# EAGLE design BUS_TEE_1 (EAGLE 6.5.0)
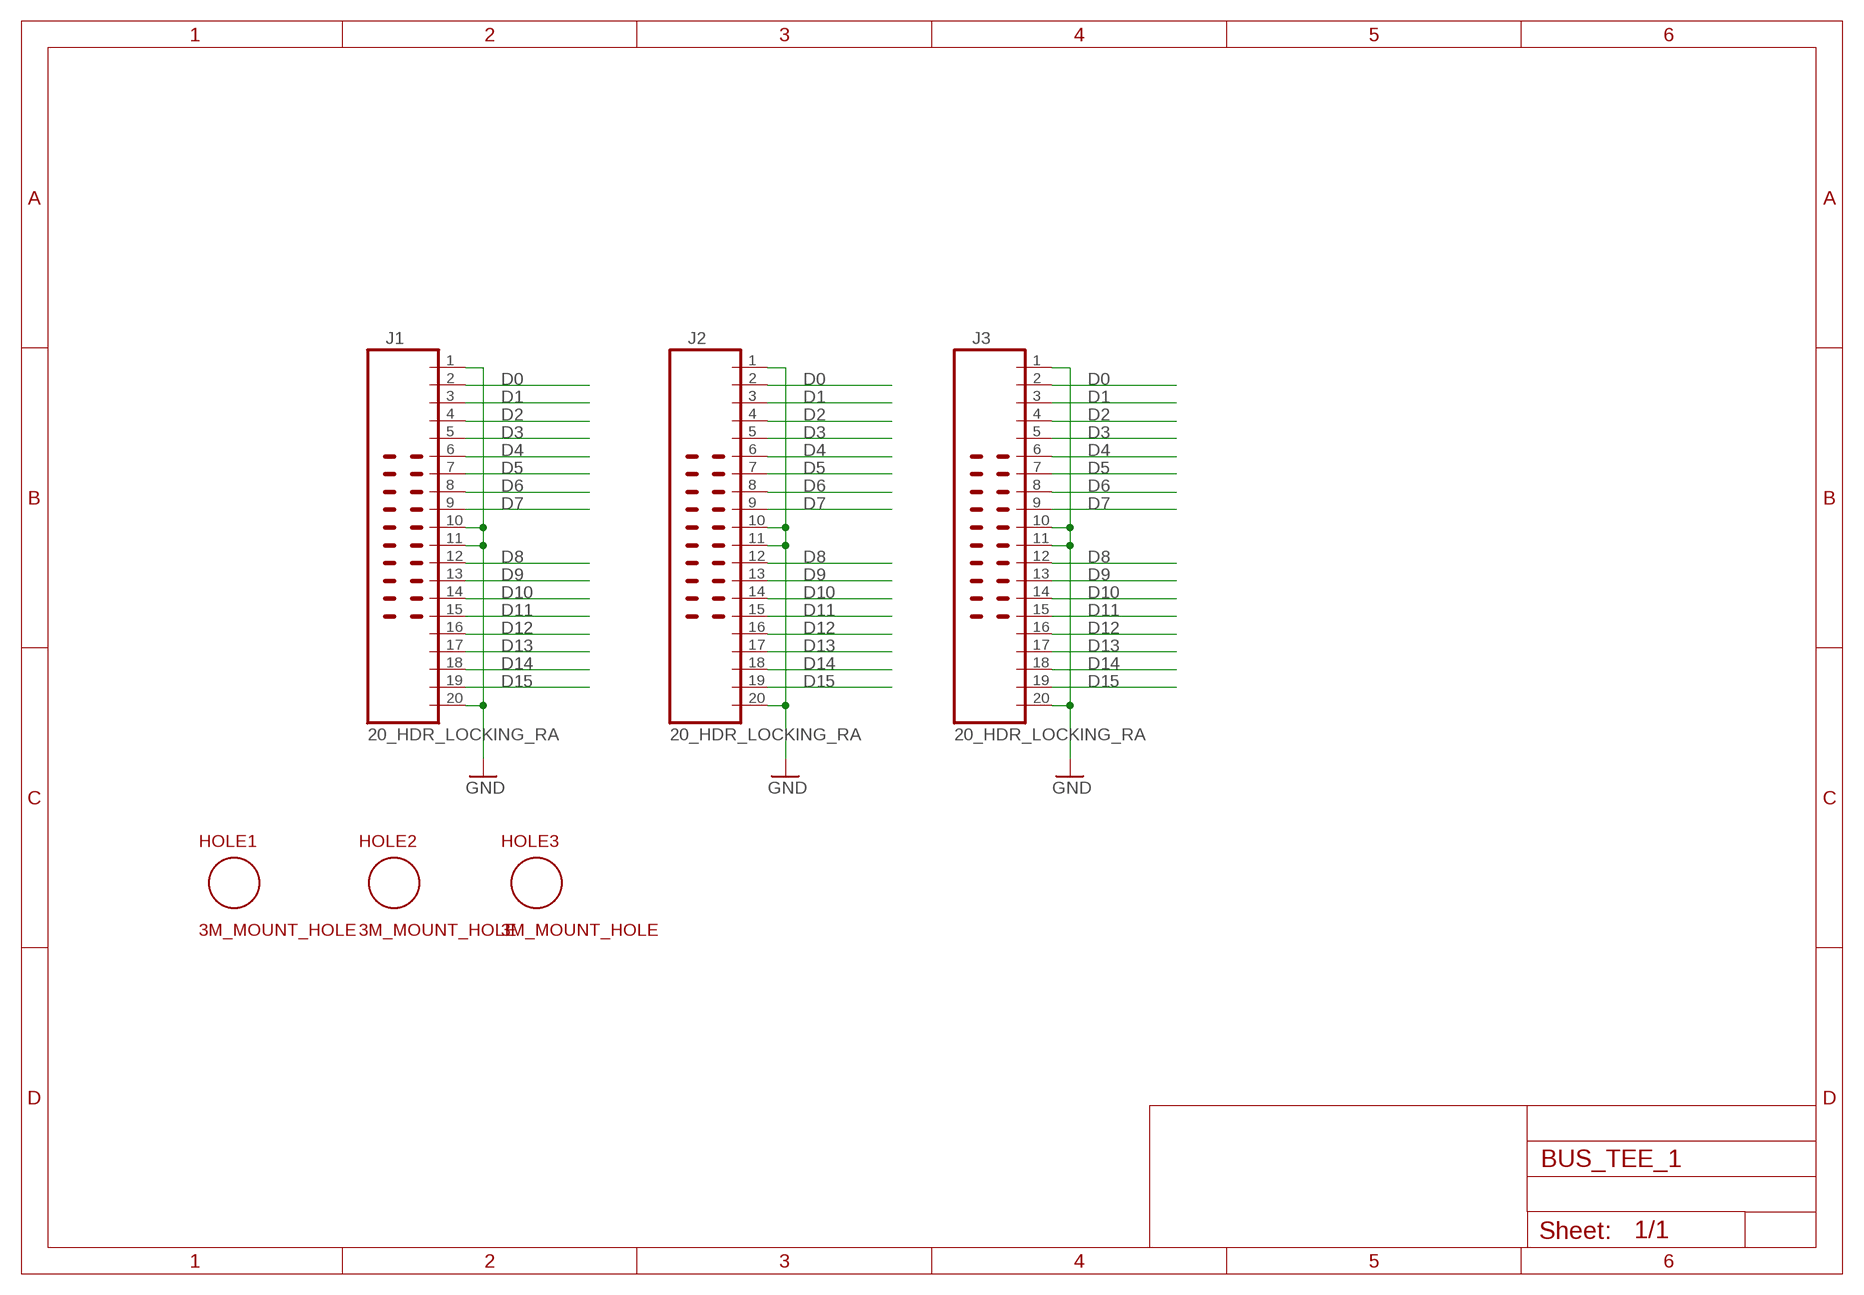
[diagram p0: schematic, sheet 1]

## Parts
HOLE1  3M_MOUNT_HOLE  [3M_HOLE]
HOLE2  3M_MOUNT_HOLE  [3M_HOLE]
HOLE3  3M_MOUNT_HOLE  [3M_HOLE]
J1  20_HDR_LOCKING_RA  [20_HDR_LOCKING_RA]
J2  20_HDR_LOCKING_RA  [20_HDR_LOCKING_RA]
J3  20_HDR_LOCKING_RA  [20_HDR_LOCKING_RA]

## Nets
D0: J1.2 J2.2 J3.2
D1: J1.3 J2.3 J3.3
D2: J1.4 J2.4 J3.4
D3: J1.5 J2.5 J3.5
D4: J1.6 J2.6 J3.6
D5: J1.7 J2.7 J3.7
D6: J1.8 J2.8 J3.8
D7: J1.9 J2.9 J3.9
D8: J1.12 J2.12 J3.12
D9: J1.13 J2.13 J3.13
D10: J1.14 J2.14 J3.14
D11: J1.15 J2.15 J3.15
D12: J1.16 J2.16 J3.16
D13: J1.17 J2.17 J3.17
D14: J1.18 J2.18 J3.18
D15: J1.19 J2.19 J3.19
GND: J1.1 J1.10 J1.11 J1.20 J2.1 J2.10 J2.11 J2.20 J3.1 J3.10 J3.11 J3.20

## Library data of the parts
HOLE1-HOLE3 = MyLib:3M_MOUNT_HOLE
J1-J3 = MyLib:20_HDR_LOCKING_RA

## Board
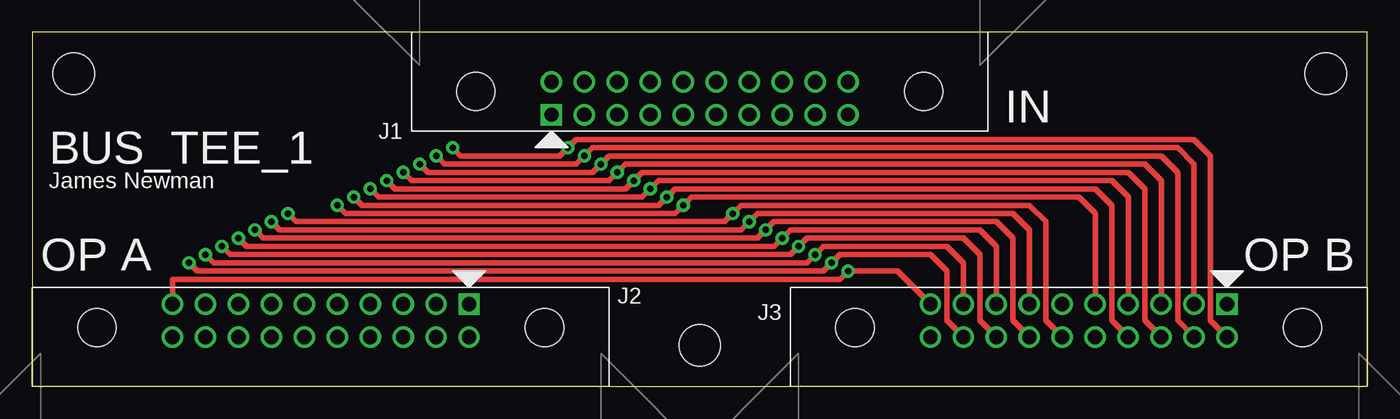
[diagram p1: board, top side]
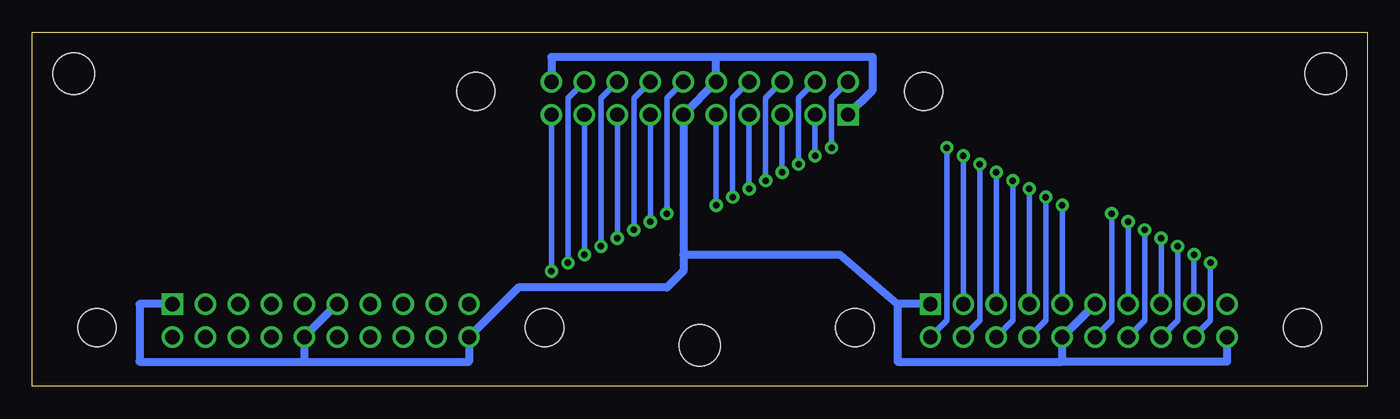
[diagram p2: board, bottom side, seen from below]

Size 102.87 x 27.3 mm. Coordinates in mm from the lower left corner, seen from the top.
Outline: 0,0 102.87,0 102.87,27.3 0,27.3 0,0
Copper layers (1*16): Top 0.035mm / dielectric 1.5mm / Bottom 0.035mm
Design rules "processor_rules_2layer *": minimum track width 8mil, minimum drill 14mil, track to track 8mil, track to pad 8mil, pad to pad 8mil, via to via 8mil, smd to smd 8mil, copper to edge 40mil, drill to drill 8mil, minimum pad ring 10mil, minimum via ring 8mil, stop-mask expansion 4mil, vias tented up to drill 0.7mm, thermal gap 10mil

### Footprints (pad centres in the part's own frame; a part is rotated, then mirrored left to right if it is on the bottom)
3M_HOLE = hole 3.2: 0,0
20_HDR_LOCKING_RA = drill 1.1 square: 1 -11.43,-1.27 | drill 1.1: 2 -11.43,1.27; 3 -8.89,-1.27; 4 -8.89,1.27; 5 -6.35,-1.27; 6 -6.35,1.27; 7 -3.81,-1.27; 8 -3.81,1.27; 9 -1.27,-1.27; 10 -1.27,1.27; 11 1.27,-1.27; 12 1.27,1.27; 13 3.81,-1.27; 14 3.81,1.27; 15 6.35,-1.27; 16 6.35,1.27; 17 8.89,-1.27; 18 8.89,1.27; 19 11.43,-1.27; 20 11.43,1.27 | hole 2.946: -17.247,0.533; 17.247,0.533

### Placement (x,y rotation side)
HOLE1  3.17,24.13 0 top
HOLE2  51.44,3.17 0 top
HOLE3  99.69,24.13 0 top
J1  51.44,22.23 0 top
J2  22.23,5.08 180 top
J3  80.64,5.08 180 top

### Tracks (layer width: path | path; a pad name or v marks a point on that pad's centre or on a via)
D0  (via drill 0.5 pad 1.02)
  Top 0.406: v32.38,18.41 33.02,17.78 40.64,17.78 v41.27,18.41 41.91,19.05 89.53,19.05 90.81,17.78 90.81,5.08 J3.2
  Bottom 0.406: J2.2 32.38,5.08 v32.38,18.41 | v41.27,18.41 41.27,22.23 J1.2
D1  (via drill 0.5 pad 1.02)
  Top 0.406: v31.11,17.78 31.75,17.14 41.91,17.14 v42.55,17.78 43.18,18.41 88.27,18.41 89.53,17.14 J3.3
  Bottom 0.406: J1.3 v42.55,17.78 | v31.11,17.78 J2.3
D2  (via drill 0.5 pad 1.02)
  Top 0.406: v29.84,17.14 30.48,16.51 43.18,16.51 v43.81,17.14 44.45,17.78 87,17.78 88.27,16.51 88.27,5.08 J3.4
  Bottom 0.406: J2.4 29.84,5.08 v29.84,17.14 | v43.81,17.14 43.81,22.23 J1.4
D3  (via drill 0.5 pad 1.02)
  Top 0.406: v28.57,16.51 29.21,15.88 44.45,15.88 v45.09,16.51 45.72,17.14 85.72,17.14 87,15.88 J3.5
  Bottom 0.406: J1.5 v45.09,16.51 | v28.57,16.51 J2.5
D4  (via drill 0.5 pad 1.02)
  Top 0.406: v27.3,15.88 27.94,15.24 45.72,15.24 v46.35,15.88 46.99,16.51 84.45,16.51 85.72,15.24 85.72,5.08 J3.6
  Bottom 0.406: J2.6 27.3,5.08 v27.3,15.88 | v46.35,15.88 46.35,22.23 J1.6
D5  (via drill 0.5 pad 1.02)
  Top 0.406: v26.04,15.24 26.67,14.61 46.99,14.61 v47.62,15.24 48.26,15.88 83.19,15.88 84.45,14.61 J3.7
  Bottom 0.406: J2.7 v26.04,15.24 | v47.62,15.24 J1.7
D6  (via drill 0.5 pad 1.02)
  Top 0.406: v24.77,14.61 25.4,13.97 48.26,13.97 v48.9,14.61 49.53,15.24 81.92,15.24 83.19,13.97 83.19,5.08 J3.8
  Bottom 0.406: J1.8 48.9,22.23 v48.9,14.61 | v24.77,14.61 24.77,5.08 J2.8
D7  (via drill 0.5 pad 1.02)
  Top 0.406: v23.5,13.97 24.13,13.34 49.53,13.34 v50.16,13.97 50.8,14.61 80.64,14.61 81.92,13.34 J3.9
  Bottom 0.406: J2.9 v23.5,13.97 | v50.16,13.97 J1.9
D8  (via drill 0.5 pad 1.02)
  Top 0.406: v19.68,13.34 20.32,12.7 53.34,12.7 v53.98,13.34 54.61,13.97 76.83,13.97 78.11,12.7 78.11,5.08 J3.12
  Bottom 0.406: J2.12 19.68,5.08 v19.68,13.34 | v53.98,13.34 53.98,22.23 J1.12
D9  (via drill 0.5 pad 1.02)
  Top 0.406: v18.41,12.7 19.05,12.06 54.61,12.06 v55.24,12.7 55.88,13.34 75.56,13.34 76.83,12.06 J3.13
  Bottom 0.406: J1.13 v55.24,12.7 | v18.41,12.7 J2.13
D10  (via drill 0.5 pad 1.02)
  Top 0.406: v17.14,12.06 17.78,11.43 55.88,11.43 v56.52,12.06 57.15,12.7 74.3,12.7 75.56,11.43 75.56,5.08 J3.14
  Bottom 0.406: J2.14 17.14,5.08 v17.14,12.06 | v56.52,12.06 56.52,22.23 J1.14
D11  (via drill 0.5 pad 1.02)
  Top 0.406: v15.88,11.43 16.51,10.79 57.15,10.79 v57.78,11.43 58.42,12.06 73.03,12.06 74.3,10.79 J3.15
  Bottom 0.406: J2.15 v15.88,11.43 | v57.78,11.43 J1.15
D12  (via drill 0.5 pad 1.02)
  Top 0.406: v14.61,10.79 15.24,10.16 58.42,10.16 v59.05,10.79 59.69,11.43 71.75,11.43 73.03,10.16 73.03,5.08 J3.16
  Bottom 0.406: J2.16 14.61,5.08 v14.61,10.79 | v59.05,10.79 59.05,22.23 J1.16
D13  (via drill 0.5 pad 1.02)
  Top 0.406: v13.34,10.16 13.97,9.53 59.69,9.53 v60.33,10.16 60.96,10.79 70.48,10.79 71.75,9.53 J3.17
  Bottom 0.406: J2.17 v13.34,10.16 | v60.33,10.16 J1.17
D14  (via drill 0.5 pad 1.02)
  Top 0.406: v12.06,9.53 12.7,8.89 60.96,8.89 v61.59,9.53 62.23,10.16 69.22,10.16 70.48,8.89 70.48,5.08 J3.18
  Bottom 0.406: J2.18 12.06,5.08 v12.06,9.53 | v61.59,9.53 61.59,22.23 J1.18
D15  (via drill 0.5 pad 1.02)
  Top 0.406: J2.19 10.79,8.26 62.23,8.26 v62.87,8.89 66.67,8.89 J3.19
  Bottom 0.406: v62.87,8.89 J1.19
GND
  Bottom 0.61: J2.20 10.79,1.91 23.5,1.91 | 23.5,1.91 J2.10 J2.11 | 23.5,1.91 36.2,1.91 36.2,6.35 | 81.92,1.91 J3.10 J3.11 | 81.92,1.91 69.22,1.91 J3.20 65.41,7.62 53.98,7.62 52.7,8.89 52.7,10.16 | J3.1 94.61,6.35 94.61,1.91 81.92,1.91 | J2.1 36.2,6.35 | J1.1 38.1,22.86 38.1,25.4 50.16,25.4 | 50.16,25.4 62.87,25.4 J1.20 | 50.16,25.4 J1.10 J1.11 52.7,10.16 | 52.7,10.16 40.64,10.16 36.2,6.35

### Text on the board
tPlace: IN | BUS_TEE_1 | James Newman | OP A | OP B